# Altium schematic sheet top.SchDoc
size A4
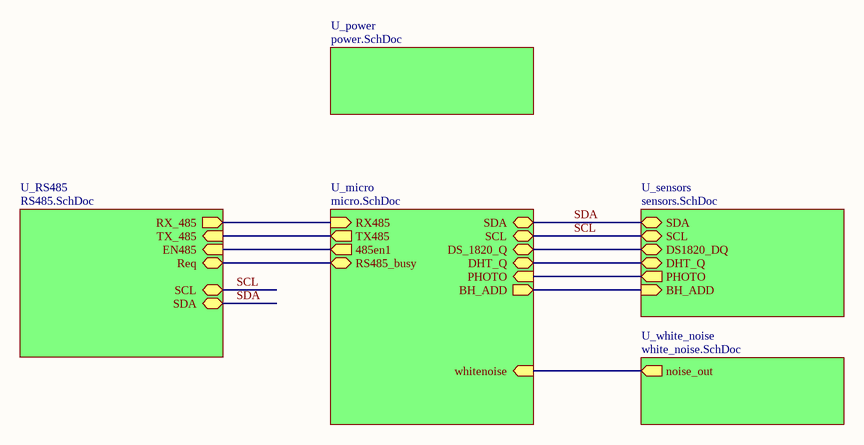
[diagram p0: top.SchDoc]

## Sub-sheets
U_micro = micro.SchDoc: whitenoise (in), SCL (bidir), SDA (bidir), RX485 (in), TX485 (out), 485en1 (out), RS485_busy (bidir), PHOTO (in), DS_1820_Q (bidir), DHT_Q (bidir), BH_ADD (out)
U_power = power.SchDoc: no entries
U_RS485 = RS485.SchDoc: RX_485 (out), EN485 (in), TX_485 (in), Req (bidir), SDA (bidir), SCL (bidir)
U_sensors = sensors.SchDoc: SDA (bidir), SCL (bidir), DS1820_DQ (bidir), DHT_Q (bidir), PHOTO (out), BH_ADD (in)
U_white_noise = white_noise.SchDoc: noise_out (out)

## Nets
SCL: sheet U_micro/SCL, sheet U_RS485/SCL, sheet U_sensors/SCL
SDA: sheet U_micro/SDA, sheet U_RS485/SDA, sheet U_sensors/SDA
(unnamed): sheet U_micro/whitenoise, sheet U_white_noise/noise_out
(unnamed): sheet U_micro/RX485, sheet U_RS485/RX_485
(unnamed): sheet U_micro/TX485, sheet U_RS485/TX_485
(unnamed): sheet U_micro/485en1, sheet U_RS485/EN485
(unnamed): sheet U_micro/RS485_busy, sheet U_RS485/Req
(unnamed): sheet U_micro/PHOTO, sheet U_sensors/PHOTO
(unnamed): sheet U_micro/DS_1820_Q, sheet U_sensors/DS1820_DQ
(unnamed): sheet U_micro/DHT_Q, sheet U_sensors/DHT_Q
(unnamed): sheet U_micro/BH_ADD, sheet U_sensors/BH_ADD